# Altium schematic sheet LED_circuits.SchDoc
size A4; CompanyName: Technische Hochschule Nürnberg Georg Simon Ohm; Organization: UltraZohm; Address1: Kesslerplatz 12; Address2: 90489 Nürnberg; Address3: GERMANY; SheetNumber: 3; SheetTotal: 6; Website: www.ultrazohm.com
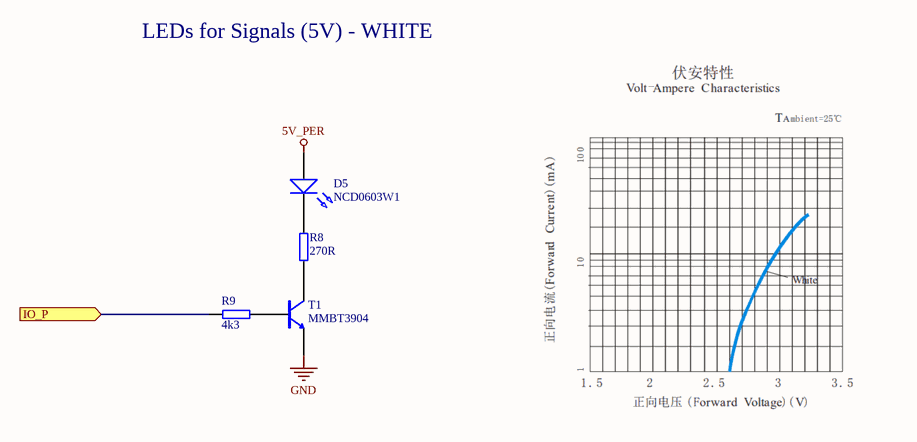
[diagram p0: LED_circuits.SchDoc]

## Parts
D5  NCD0603W1  [WL-SMCW_0603]
R8  270R  [RES 0603_1608]
R9  4k3  [RES 0603_1608]
T1  MMBT3904  [SOT95P280X145-3N]

## Ports
IO_P (in)

## Nets
5V_PER: D5.2(A)
GND: T1.2(EMITTER)
IO_P: R9.1 ; port IO_P
NetD5_1: D5.1(K) R8.2
NetR8_1: R8.1 T1.3(COLLECTOR)
NetR9_2: R9.2 T1.1(BASIS)

## Notes on the sheet
- LEDs for Signals (5V) - WHITE
- Title
- Revision:
- Design Engineer:
- Date:
- Project:
- Sheet
- of

## Library data of the parts
D5 = NCD0603W1: White light 0603 Light Emitting Diodes (LED) ROHS; Manufacturer: Foshan NationStar Optoelectronics; Type: Standard; Created from: NDiringer; Forward Current I_f: 20 mA; Forward Voltage U_f: 2.8 V; Light Intensity: 250 mcd; Nominal Power: 72 mW; Manufacturer Part Number: NCD0603W1; PartID: 13; Created On: 03.05.2022 13:11:03; ComponentLink1Description: Datasheet; ComponentLink1URL: https://datasheet.lcsc.com/lcsc/2008201032_Foshan-NationStar-Optoelectronics-NCD0603W1_C84265.pdf; Component Type: LED Diode; Device Package: 0603; Last Updated: 03.05.2022 13:27:48; Mounting Type: SMD; Operating Temperature: -40 - 85 °C; Supplier 1: LCSC; Supplier Part Number 1: C84265; Live Cycle Status: 1; Stock number: not stored; Color: white; LCSC Part Number: C84265
R8 = 0603WAF2700T5E: 1/10W Thick Film Resistors 75V ±1% ±100ppm/℃ -55℃~+155℃ 270Ω 0603 Chip Resistor - Surface Mount ROHS; Manufacturer: UNI-ROYAL(Uniroyal Elec); Created from: NDiringer; Manufacturer Part Number: 0603WAF2700T5E; PartID: 228; Created On: 10.08.2022 13:23:32; ComponentLink1Description: Datasheet; ComponentLink1URL: https://datasheet.lcsc.com/lcsc/2206010130_UNI-ROYAL-Uniroyal-Elec-0603WAF2700T5E_C22966.pdf; Component Type: SMD resistor; Device Package: 0603; Last Updated: 10.08.2022 13:40:57; Mounting Type: SMD; Supplier 1: LCSC/JLCPCB; Supplier Part Number 1: C22966; Supplier 2: Mouser; Supplier Part Number 2: 303-0603WAF2700T5E; Type: Resistor; Tolerance: 1%; Value: 270R; Live Cycle Status: 1; Stock number: not stored; LCSC Part Number: C22966
R9 = 0603WAF4301T5E: 1/10W Thick Film Resistors 75V ±1% ±100ppm/℃ -55℃~+155℃ 4.3kΩ 0603 Chip Resistor - Surface Mount ROHS; Manufacturer: UNI-ROYAL(Uniroyal Elec); Created from: NDiringer; Manufacturer Part Number: 0603WAF4301T5E; PartID: 226; Created On: 10.08.2022 13:07:09; ComponentLink1Description: Datasheet; ComponentLink1URL: https://datasheet.lcsc.com/lcsc/2206010116_UNI-ROYAL-Uniroyal-Elec-0603WAF4301T5E_C23159.pdf; Component Type: SMD resistor; Device Package: 0603; Last Updated: 10.08.2022 13:39:46; Mounting Type: SMD; Supplier 1: LCSC/JLCPCB; Supplier Part Number 1: C23159; Supplier 2: Mouser; Supplier Part Number 2: 303-0603WAF4301T5E; Type: Resistor; Tolerance: 1%; Value: 4k3; Live Cycle Status: 1; Stock number: not stored; LCSC Part Number: C23159
T1 = MMBT3904: Bipolartransistor, 40V 200mW 200mA 100@10mA,1V 300MHz 300mV@50mA,5mA NPN +150℃@(Tj) SOT-23(SOT-23-3); Manufacturer: Jiangsu Changjing Electronics Technology Co., Ltd.; Number Of Channels: single; Collector Basis Voltage: 60 V; Created from: NDiringer; Manufacturer Part Number: MMBT3904; PartID: 2; Created On: 10.06.2022 12:04:49; ComponentLink1Description: Datasheet; ComponentLink1URL: https://datasheet.lcsc.com/lcsc/1811011934_Jiangsu-Changjing-Electronics-Technology-Co---Ltd--MMBT3904_C20526.pdf; Component Type: Bipolartransistor; Device Package: SOT-23-3; Last Updated: 10.08.2022 13:48:16; Mounting Type: SMD; Operating Temperature: -55 - 150 °C; Series: MMBT3904; Supplier 1: Mouser; Supplier Part Number 1: MMBT3904; Type: Bipolartransistor; Collector Emitter Voltage: 40 V; Polarization: NPN; Power Dissipation: 200 mW; Value: 40 V; Live Cycle Status: 1; Supplier 2: LCSC/JLCPCB; Supplier Part Number 2: C20526; LCSC Part Number: C20526